# EAGLE design PicoElf2 (EAGLE 4.11)
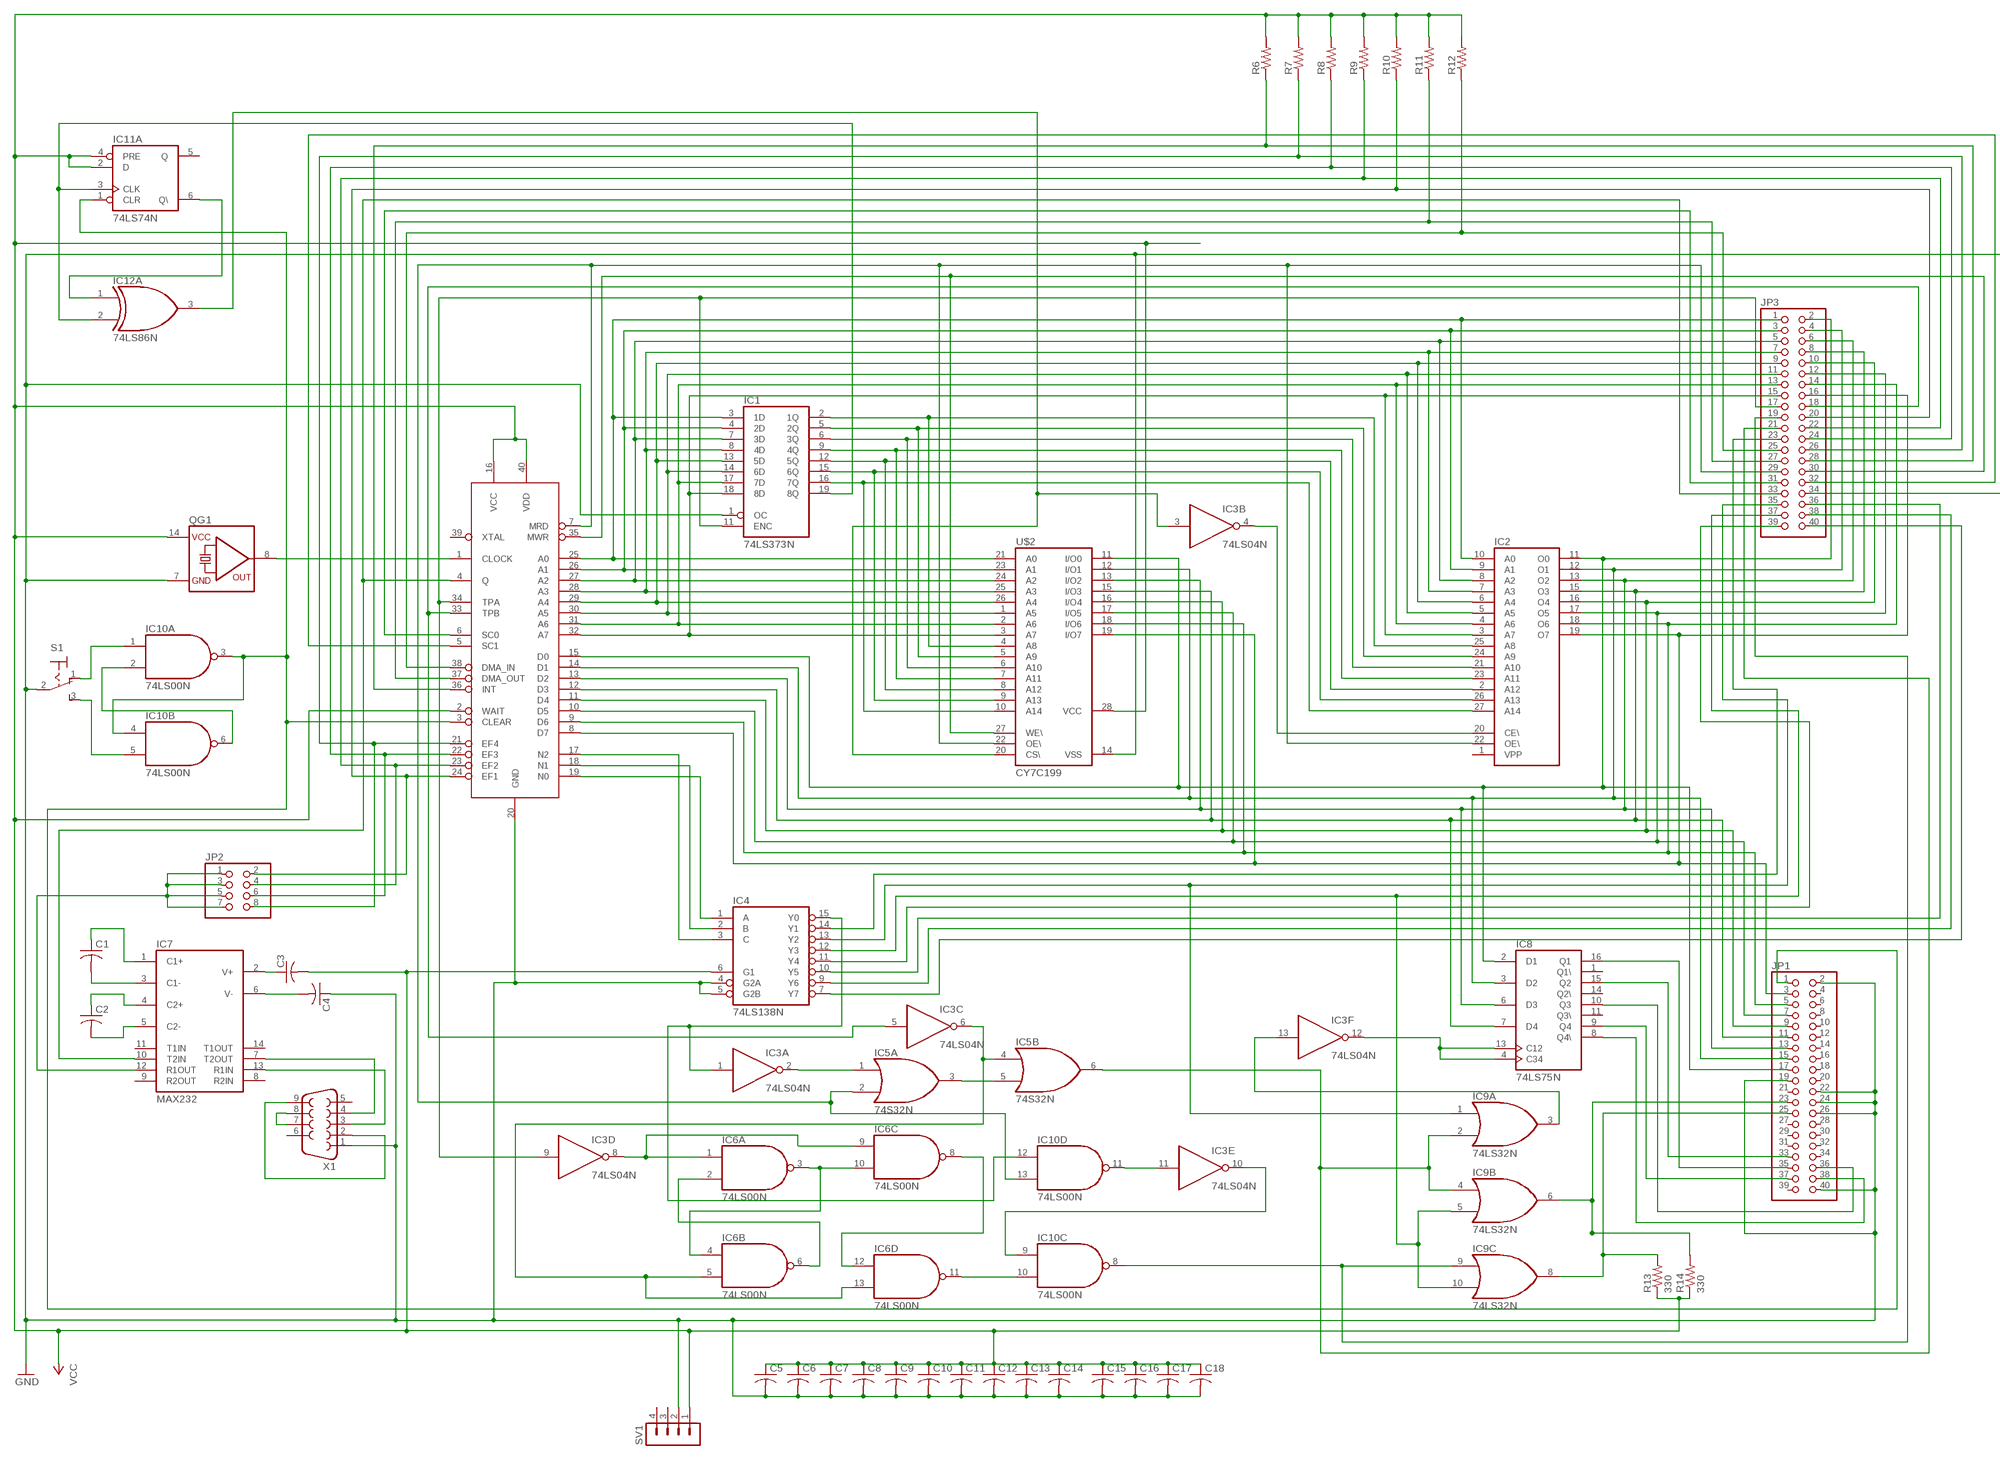
[diagram p0: schematic, sheet 1]

## Parts
C1  C-US025-025X050  [C025-025X050]
C2  C-US025-025X050  [C025-025X050]
C3  C-US025-025X050  [C025-025X050]
C4  C-US025-025X050  [C025-025X050]
C5  C-US025-025X050  [C025-025X050]
C6  C-US025-025X050  [C025-025X050]
C7  C-US025-025X050  [C025-025X050]
C8  C-US025-025X050  [C025-025X050]
C9  C-US025-025X050  [C025-025X050]
C10  C-US025-025X050  [C025-025X050]
C11  C-US025-025X050  [C025-025X050]
C12  C-US025-025X050  [C025-025X050]
C13  C-US025-025X050  [C025-025X050]
C14  C-US025-025X050  [C025-025X050]
C15  C-US025-025X050  [C025-025X050]
C16  C-US025-025X050  [C025-025X050]
C17  C-US025-025X050  [C025-025X050]
C18  C-US025-025X050  [C025-025X050]
IC1  74LS373N  [DIL20]
IC2  27256  [DIL28]
IC3  74LS04N  [DIL14]
IC4  74LS138N  [DIL16]
IC5  74S32N  [DIL14]
IC6  74LS00N  [DIL14]
IC7  MAX232  [DIL16]
IC8  74LS75N  [DIL16]
IC9  74LS32N  [DIL14]
IC10  74LS00N  [DIL14]
IC11  74LS74N  [DIL14]
IC12  74LS86N  [DIL14]
JP1  PINHD-2X20  [2X20]
JP2  PINHD-2X4  [2X04]
JP3  PINHD-2X20  [2X20]
QG1  QG5860  [DIL14S]
R6  R-US_0207/2V  [0207/2V]
R7  R-US_0207/2V  [0207/2V]
R8  R-US_0207/2V  [0207/2V]
R9  R-US_0207/2V  [0207/2V]
R10  R-US_0207/2V  [0207/2V]
R11  R-US_0207/2V  [0207/2V]
R12  R-US_0207/2V  [0207/2V]
R13  330  R-US_0207/2V  [0207/2V]
R14  330  R-US_0207/2V  [0207/2V]
S1  320-916  [320-916]
SV1  MA04-1  [MA04-1]
U$1  CDP1802BCECDP1802BCE  [DIL40]
U$2  CY7C199  [DIL28-3]
X1  F09H  [F09H]

## Nets
A0: IC1.3(1D) IC2.10(A0) JP3.1 U$1.25(A0) U$2.21(A0)
A1: IC1.4(2D) IC2.9(A1) JP3.3 U$1.26(A1) U$2.23(A1)
A2: IC1.7(3D) IC2.8(A2) JP3.5 U$1.27(A2) U$2.24(A2)
A3: IC1.8(4D) IC2.7(A3) JP3.7 U$1.28(A3) U$2.25(A3)
A4: IC1.13(5D) IC2.6(A4) JP3.9 U$1.29(A4) U$2.26(A4)
A5: IC1.14(6D) IC2.5(A5) JP3.11 U$1.30(A5) U$2.1(A5)
A6: IC1.17(7D) IC2.4(A6) JP3.13 U$1.31(A6) U$2.2(A6)
A7: IC1.18(8D) IC2.3(A7) JP3.15 U$1.32(A7) U$2.3(A7)
A8: IC1.2(1Q) IC2.25(A8) U$2.4(A8)
A9: IC1.5(2Q) IC2.24(A9) U$2.5(A9)
A10: IC1.6(3Q) IC2.21(A10) U$2.6(A10)
A11: IC1.9(4Q) IC2.23(A11) U$2.7(A11)
A12: IC1.12(5Q) IC2.2(A12) U$2.8(A12)
A13: IC1.15(6Q) IC2.26(A13) U$2.9(A13)
A14: IC1.16(7Q) IC2.27(A14) U$2.10(A14)
A15: IC1.19(8Q) IC11.3(A:CLK) IC12.2(A:I1)
CLOCK: QG1.8(OUT) U$1.1(CLOCK)
D0: IC2.11(O0) IC8.2(D1) JP1.17 JP3.2 U$1.15(D0) U$2.11(I/O0)
D1: IC2.12(O1) IC8.3(D2) JP1.15 JP3.4 U$1.14(D1) U$2.12(I/O1)
D2: IC2.13(O2) IC8.6(D3) JP1.13 JP3.6 U$1.13(D2) U$2.13(I/O2)
D3: IC2.15(O3) IC8.7(D4) JP1.11 JP3.8 U$1.12(D3) U$2.15(I/O3)
D4: IC2.16(O4) JP1.9 JP3.10 U$1.11(D4) U$2.16(I/O4)
D5: IC2.17(O5) JP1.7 JP3.12 U$1.10(D5) U$2.17(I/O5)
D6: IC2.18(O6) JP1.5 JP3.14 U$1.9(D6) U$2.18(I/O6)
D7: IC2.19(O7) JP1.3 JP3.16 U$1.8(D7) U$2.19(I/O7)
DMA_IN: JP3.25 R12.1 U$1.38(DMA_IN)
DMA_OUT: JP3.27 R11.1 U$1.37(DMA_OUT)
EF1: JP2.2 JP3.20 R10.1 U$1.24(EF1)
EF2: JP2.4 JP3.22 R9.1 U$1.23(EF2)
EF3: JP2.6 JP3.24 R8.1 U$1.22(EF3)
EF4: JP2.8 JP3.26 R7.1 U$1.21(EF4)
GND: C4.1 C5.2 C6.2 C7.2 C8.2 C9.2 C10.2 C11.2 C12.2 C13.2 C14.2 C15.2 C16.2 C17.2 C18.2 IC1.1(OC) IC4.4(G2A) IC4.5(G2B) JP1.2 JP1.19 JP1.22 JP1.24 JP1.26 JP1.40 JP3.34 QG1.7(GND) S1.2(P) SV1.2 U$1.20(GND) U$2.14(VSS) X1.1
INP: IC9.9(C:I0) IC10.8(C:O) JP3.19
INT: JP3.28 R6.1 U$1.36(INT)
MRD: IC2.22(OE\) IC5.2(A:I1) IC10.13(D:I1) JP3.29 U$1.7(MRD) U$2.22(OE\)
MWR: JP3.30 U$1.35(MWR) U$2.27(WE\)
N$1: IC2.20(CE\) IC3.4(B:O)
N$2: IC11.6(A:Q\) IC12.1(A:I0)
N$3: IC4.1(A) U$1.19(N0)
N$4: IC4.2(B) U$1.18(N1)
N$5: IC4.3(C) U$1.17(N2)
N$6: IC3.1(A:I) IC4.15(Y0) IC10.12(D:I0)
N$7: IC3.2(A:O) IC5.1(A:I0)
N$8: IC6.3(A:O) IC6.4(B:I0) IC6.10(C:I1)
N$9: IC5.3(A:O) IC5.5(B:I1)
N$10: IC3.6(C:O) IC5.4(B:I0) IC6.5(B:I1) IC6.13(D:I1)
N$11: IC6.2(A:I1) IC6.6(B:O)
N$12: IC3.8(D:O) IC6.1(A:I0) IC6.9(C:I0)
N$13: IC3.10(E:O) IC10.9(C:I0)
N$14: IC6.8(C:O) IC6.12(D:I0)
N$15: IC3.13(F:I) IC9.3(A:O)
N$16: IC6.11(D:O) IC10.10(C:I1)
N$17: IC3.11(E:I) IC10.11(D:O)
N$19: JP3.32 U$1.5(SC1)
N$20: IC3.3(B:I) IC12.3(A:O) U$2.20(CS\)
N$21: C2.1 IC7.4(C2+)
N$22: C2.2 IC7.5(C2-)
N$23: IC3.12(F:O) IC8.4(C34) IC8.13(C12)
N$24: IC8.16(Q1) JP1.35
N$25: IC8.15(Q2) JP1.33
N$26: IC8.10(Q3) JP1.36
N$27: IC8.9(Q4) JP1.37
N$28: IC8.8(Q4\) JP1.38
N$29: IC9.6(B:O) JP1.23 R14.2
N$30: IC9.8(C:O) JP1.25 R13.2
N$31: C1.2 IC7.3(C1-)
N$32: IC7.13(R1IN) X1.3
N$33: IC10.1(A:I0) S1.1(O)
N$34: C1.1 IC7.1(C1+)
N$35: X1.7 X1.8
N$36: X1.2 X1.9
N$37: IC7.12(R1OUT) JP2.1 JP2.3 JP2.5 JP2.7
N$38: C3.1 IC7.2(V+)
N$39: C4.2 IC7.6(V-)
N$40: IC7.7(T2OUT) X1.4
N$43: IC10.5(B:I1) S1.3(S)
N$46: IC10.2(A:I1) IC10.6(B:O)
OUT: IC5.6(B:O) IC9.2(A:I1) IC9.4(B:I0) JP3.21
PORT1: IC4.14(Y1) JP3.23
PORT2: IC4.13(Y2) IC9.1(A:I0) JP3.35
PORT3: IC4.12(Y3) IC9.5(B:I1) IC9.10(C:I1) JP3.37
PORT4: IC4.11(Y4) JP3.39
PORT5: IC4.10(Y5) JP3.36
PORT6: IC4.9(Y6) JP3.38
PORT7: IC4.7(Y7) JP3.40
Q: IC7.10(T2IN) JP3.33 U$1.4(Q)
RESET: IC10.3(A:O) IC10.4(B:I0) IC11.1(A:CLR) JP1.1 U$1.3(CLEAR)
SC0: JP3.31 U$1.6(SC0)
TPA: IC1.11(ENC) IC3.9(D:I) JP3.17 U$1.34(TPA)
TPB: IC3.5(C:I) JP3.18 U$1.33(TPB)
VCC: C3.2 C5.1 C6.1 C7.1 C8.1 C9.1 C10.1 C11.1 C12.1 C13.1 C14.1 C15.1 C16.1 C17.1 C18.1 IC4.6(G1) IC11.2(A:D) IC11.4(A:PRE) QG1.14(VCC) R6.2 R7.2 R8.2 R9.2 R10.2 R11.2 R12.2 R13.1 R14.1 SV1.1 U$1.2(WAIT) U$1.16(VCC) U$1.40(VDD) U$2.28(VCC)
Unconnected: IC2.1(VPP) IC5.8(C:O) IC5.9(C:I0) IC5.10(C:I1) IC5.11(D:O) IC5.12(D:I0) IC5.13(D:I1) IC7.8(R2IN) IC7.9(R2OUT) IC7.11(T1IN) IC7.14(T1OUT) IC8.1(Q1\) IC8.11(Q3\) IC8.14(Q2\) IC9.11(D:O) IC9.12(D:I0) IC9.13(D:I1) IC11.5(A:Q) IC11.8(B:Q\) IC11.9(B:Q) IC11.10(B:PRE) IC11.11(B:CLK) IC11.12(B:D) IC11.13(B:CLR) IC12.4(B:I0) IC12.5(B:I1) IC12.6(B:O) IC12.8(C:O) IC12.9(C:I0) IC12.10(C:I1) IC12.11(D:O) IC12.12(D:I0) IC12.13(D:I1) JP1.4 JP1.6 JP1.8 JP1.10 JP1.12 JP1.14 JP1.16 JP1.18 JP1.20 JP1.21 JP1.27 JP1.28 JP1.29 JP1.30 JP1.31 JP1.32 JP1.34 JP1.39 SV1.3 SV1.4 U$1.39(XTAL) X1.5 X1.6

## Power pins joined to a net without a drawn wire
GND: IC1.10(GND) IC2.14(GND) IC3.7(P:GND) IC4.8(GND) IC5.7(P:GND) IC6.7(P:GND) IC7.15(GND) IC8.12(GND) IC9.7(P:GND) IC10.7(P:GND) IC11.7(P:GND) IC12.7(P:GND)
VCC: IC1.20(VCC) IC2.28(VCC) IC3.14(P:VCC) IC4.16(VCC) IC5.14(P:VCC) IC6.14(P:VCC) IC7.16(VCC) IC8.5(VCC) IC9.14(P:VCC) IC10.14(P:VCC) IC11.14(P:VCC) IC12.14(P:VCC)

## Library data of the parts
C1-C18 = rcl:C-US: CAPACITOR, American symbol
IC1 = 74xx-us:74*373: Octal D type transparent LATCH, edge triggered
IC2 = memory:27256: MEMORY
IC3 = 74xx-us:74*04: Hex INVERTER
IC4 = 74xx-us:74*138: 3-line to 8-line DECODER/DEMULTIPLEXER
IC5 IC9 = 74xx-us:74*32: Quad 2-input OR gate
IC6 IC10 = 74xx-us:74*00: Quad 2-input NAND gate
IC7 = maxim:MAX232: RS232 TRANSEIVER
IC8 = 74xx-us:74*75: 4-bit bistable LATCH
IC11 = 74xx-us:74*74: Dual D type positive edge triggered FLIP FLOP, preset and clear
IC12 = 74xx-us:74*86: Quad 2-input EXCLUSIV-OR (XOR) gate
JP1 JP3 = pinhead:PINHD-2X20: PIN HEADER
JP2 = pinhead:PINHD-2X4: PIN HEADER
QG1 = crystal:QG5860: CRYSTAL RESONATOR
R6-R14 = rcl:R-US_: RESISTOR, American symbol
S1 = switch:320-916: TOGGLE SWITCH distributor RS Components
SV1 = con-lstb:MA04-1: PIN HEADER
U$1 = cdp:CDP1802BCE
U$2 = cdp:CY7C199
X1 = con-subd:F09: SUB-D

## Board
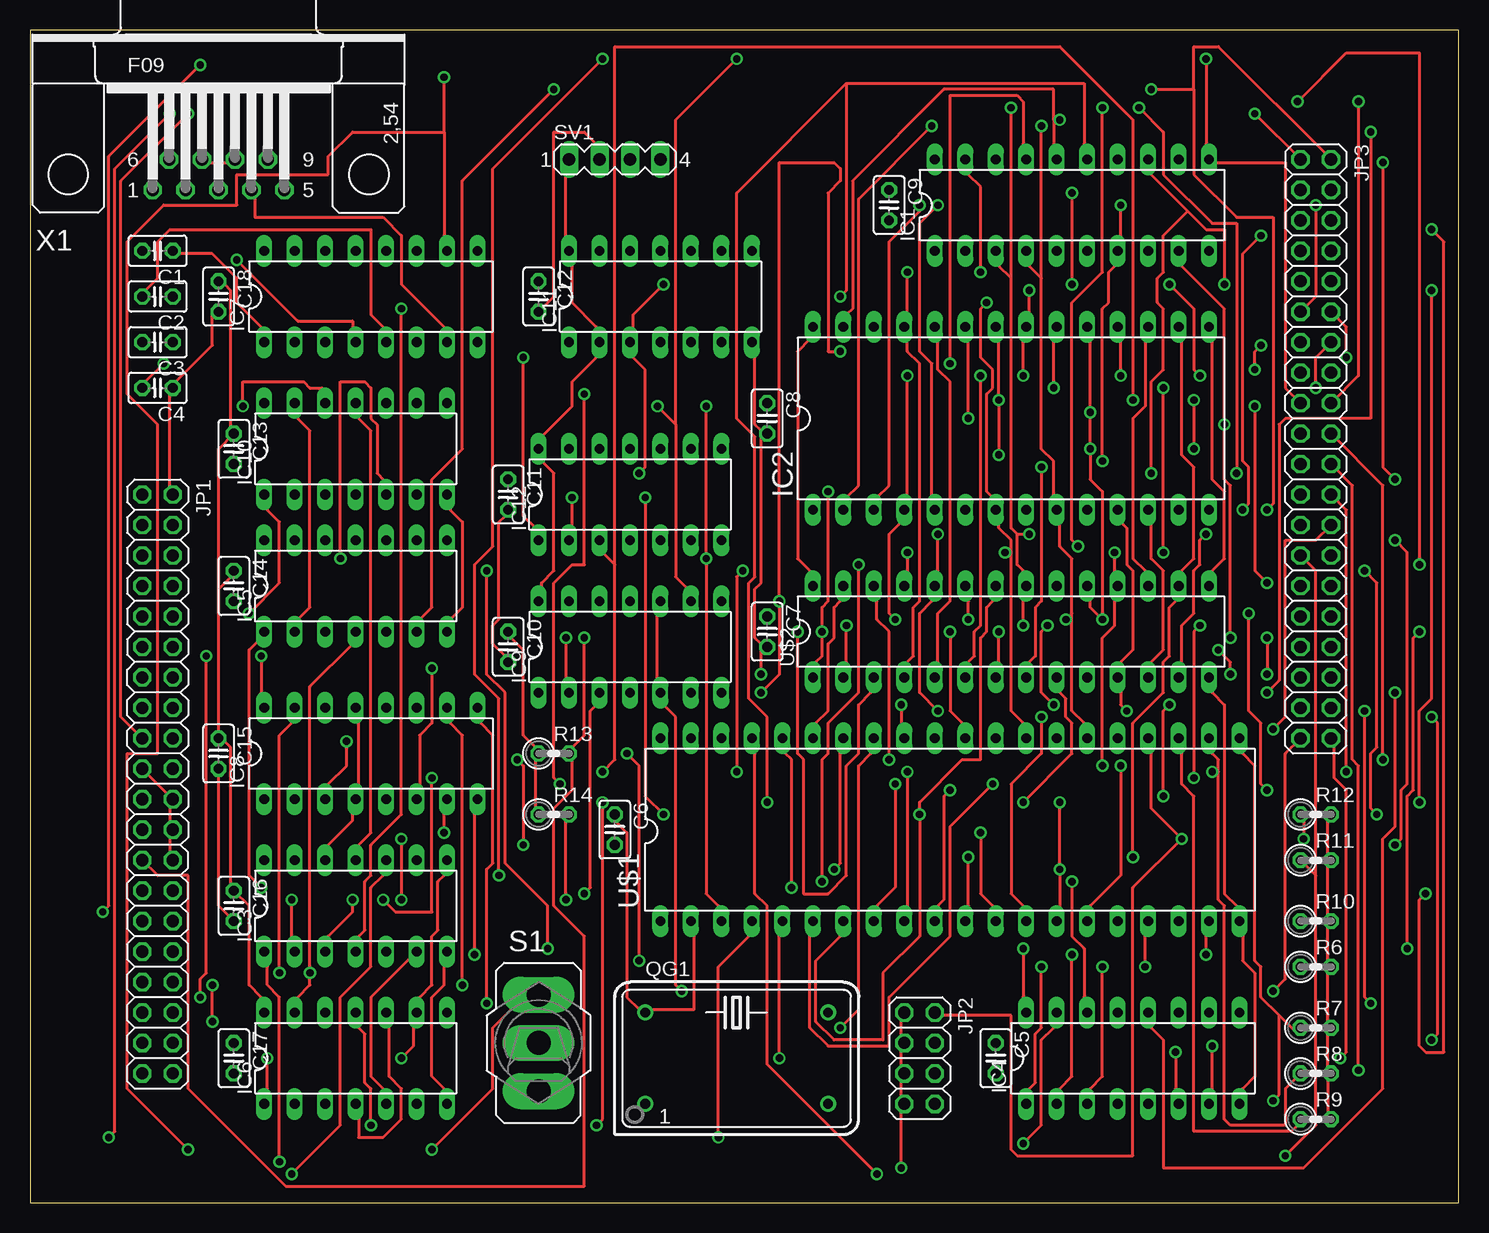
[diagram p1: board, top side]
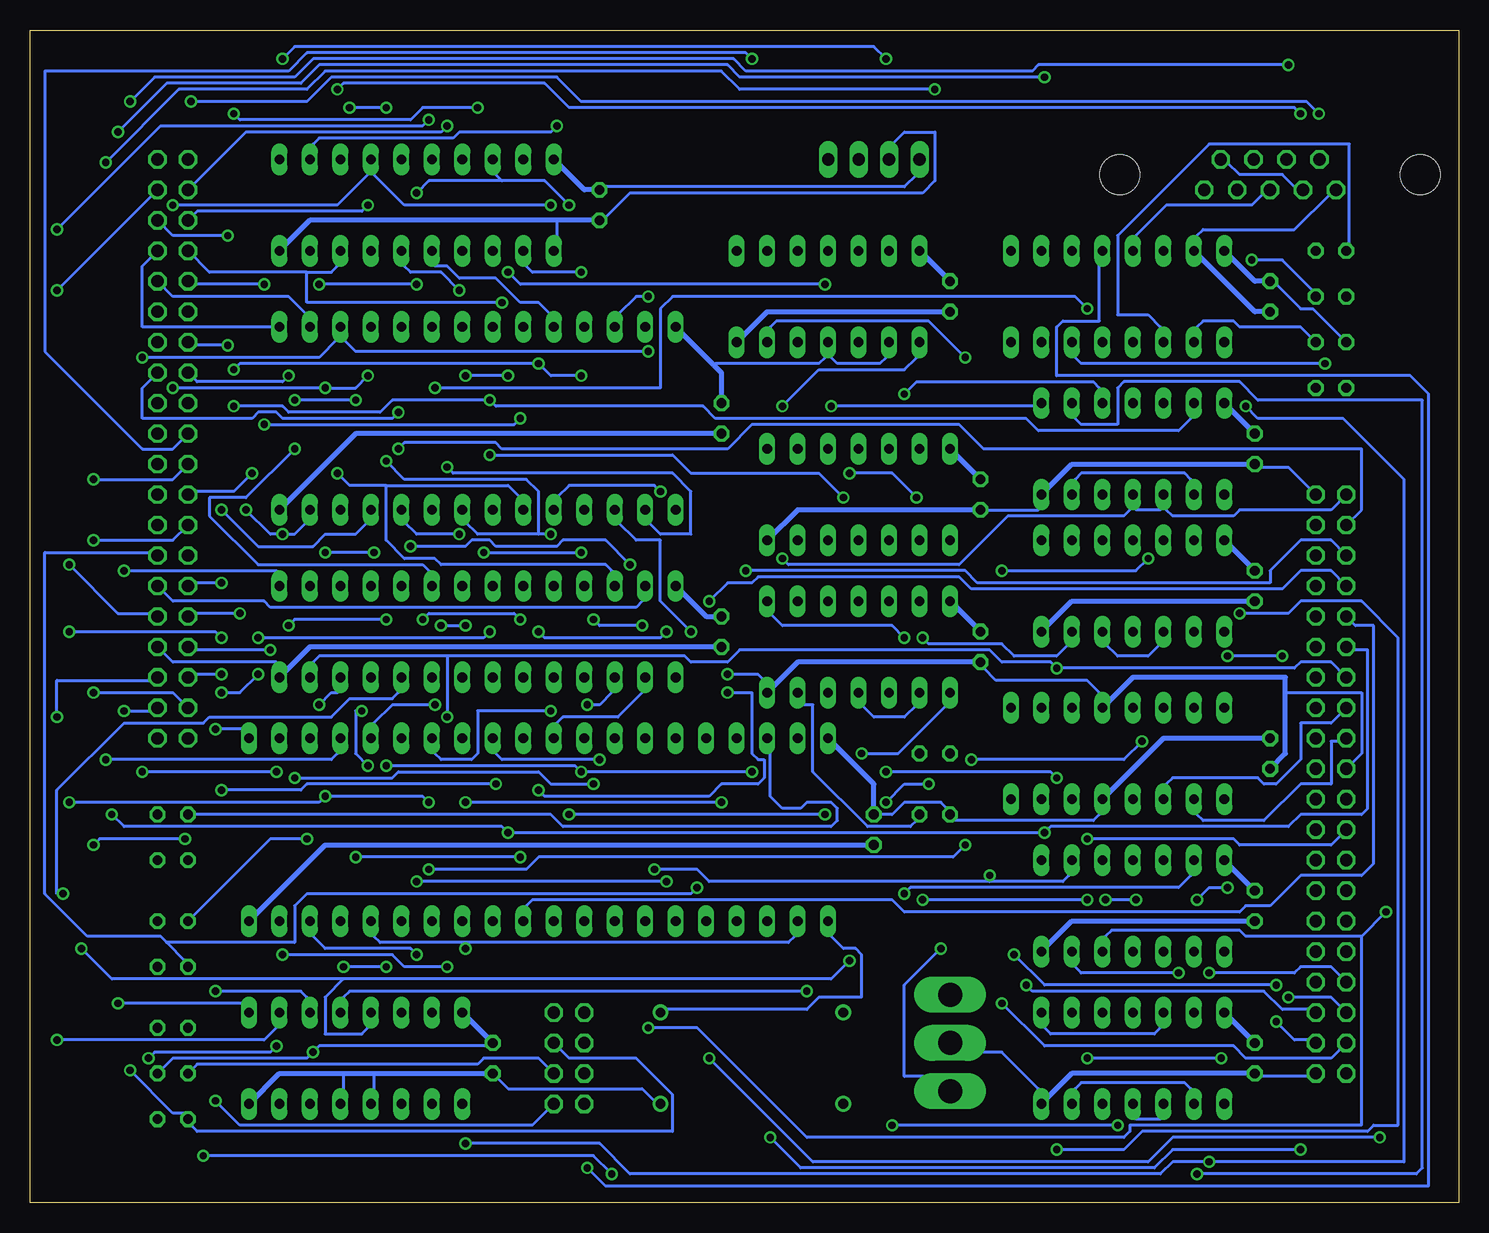
[diagram p2: board, bottom side, seen from below]

Size 119.05 x 97.78 mm. Coordinates in mm from the lower left corner, seen from the top.
Outline: 0,0 119.05,0 119.05,97.78 0,97.78 0,0
Copper layers (1*16): Top 0.035mm / dielectric 1.5mm / Bottom 0.035mm
Design rules "default": minimum track width 10mil, minimum drill 24mil, track to track 8mil, track to pad 8mil, pad to pad 8mil, via to via 8mil, smd to smd 8mil, copper to edge 40mil, drill to drill 8mil, minimum pad ring 10mil, minimum via ring 8mil, stop-mask expansion 4mil, vias tented up to drill 0mil, thermal gap 10mil

### Footprints (pad centres in the part's own frame; a part is rotated, then mirrored left to right if it is on the bottom)
C025-025X050 = drill 0.813 octagon: 1 -1.27,0; 2 1.27,0
DIL20 = drill 0.813 long: 1 -11.43,-3.81; 2 -8.89,-3.81; 3 -6.35,-3.81; 4 -3.81,-3.81; 5 -1.27,-3.81; 6 1.27,-3.81; 7 3.81,-3.81; 8 6.35,-3.81; 9 8.89,-3.81; 10 11.43,-3.81; 11 11.43,3.81; 12 8.89,3.81; 13 6.35,3.81; 14 3.81,3.81; 15 1.27,3.81; 16 -1.27,3.81; 17 -3.81,3.81; 18 -6.35,3.81; 19 -8.89,3.81; 20 -11.43,3.81
DIL28 = drill 0.813 long: 1 -16.51,-7.62; 2 -13.97,-7.62; 3 -11.43,-7.62; 4 -8.89,-7.62; 5 -6.35,-7.62; 6 -3.81,-7.62; 7 -1.27,-7.62; 8 1.27,-7.62; 9 3.81,-7.62; 10 6.35,-7.62; 11 8.89,-7.62; 12 11.43,-7.62; 13 13.97,-7.62; 14 16.51,-7.62; 15 16.51,7.62; 16 13.97,7.62; 17 11.43,7.62; 18 8.89,7.62; 19 6.35,7.62; 20 3.81,7.62; 21 1.27,7.62; 22 -1.27,7.62; 23 -3.81,7.62; 24 -6.35,7.62; 25 -8.89,7.62; 26 -11.43,7.62; 27 -13.97,7.62; 28 -16.51,7.62
DIL14 = drill 0.813 long: 1 -7.62,-3.81; 2 -5.08,-3.81; 3 -2.54,-3.81; 4 0,-3.81; 5 2.54,-3.81; 6 5.08,-3.81; 7 7.62,-3.81; 8 7.62,3.81; 9 5.08,3.81; 10 2.54,3.81; 11 0,3.81; 12 -2.54,3.81; 13 -5.08,3.81; 14 -7.62,3.81
DIL16 = drill 0.813 long: 1 -8.89,-3.81; 2 -6.35,-3.81; 3 -3.81,-3.81; 4 -1.27,-3.81; 5 1.27,-3.81; 6 3.81,-3.81; 7 6.35,-3.81; 8 8.89,-3.81; 9 8.89,3.81; 10 6.35,3.81; 11 3.81,3.81; 12 1.27,3.81; 13 -1.27,3.81; 14 -3.81,3.81; 15 -6.35,3.81; 16 -8.89,3.81
2X20 = drill 1.016 octagon: 1 -24.13,-1.27; 2 -24.13,1.27; 3 -21.59,-1.27; 4 -21.59,1.27; 5 -19.05,-1.27; 6 -19.05,1.27; 7 -16.51,-1.27; 8 -16.51,1.27; 9 -13.97,-1.27; 10 -13.97,1.27; 11 -11.43,-1.27; 12 -11.43,1.27; 13 -8.89,-1.27; 14 -8.89,1.27; 15 -6.35,-1.27; 16 -6.35,1.27; 17 -3.81,-1.27; 18 -3.81,1.27; 19 -1.27,-1.27; 20 -1.27,1.27; 21 1.27,-1.27; 22 1.27,1.27; 23 3.81,-1.27; 24 3.81,1.27; 25 6.35,-1.27; 26 6.35,1.27; 27 8.89,-1.27; 28 8.89,1.27; 29 11.43,-1.27; 30 11.43,1.27; 31 13.97,-1.27; 32 13.97,1.27; 33 16.51,-1.27; 34 16.51,1.27; 35 19.05,-1.27; 36 19.05,1.27; 37 21.59,-1.27; 38 21.59,1.27; 39 24.13,-1.27; 40 24.13,1.27
2X04 = drill 1.016 octagon: 1 -3.81,-1.27; 2 -3.81,1.27; 3 -1.27,-1.27; 4 -1.27,1.27; 5 1.27,-1.27; 6 1.27,1.27; 7 3.81,-1.27; 8 3.81,1.27
DIL14S = drill 0.813 round: 1 -7.62,-3.81; 7 7.62,-3.81; 8 7.62,3.81; 14 -7.62,3.81
0207/2V = drill 0.813 octagon: 1 -1.27,0; 2 1.27,0
320-916 = drill 2.007 long: 1 0,4.013; 2 0,0; 3 0,-4.013
MA04-1 = drill 1.016 long: 1 -3.81,0; 2 -1.27,0; 3 1.27,0; 4 3.81,0
DIL40 = drill 0.813 long: 1 -24.13,-7.62; 2 -21.59,-7.62; 3 -19.05,-7.62; 4 -16.51,-7.62; 5 -13.97,-7.62; 6 -11.43,-7.62; 7 -8.89,-7.62; 8 -6.35,-7.62; 9 -3.81,-7.62; 10 -1.27,-7.62; 11 1.27,-7.62; 12 3.81,-7.62; 13 6.35,-7.62; 14 8.89,-7.62; 15 11.43,-7.62; 16 13.97,-7.62; 17 16.51,-7.62; 18 19.05,-7.62; 19 21.59,-7.62; 20 24.13,-7.62; 21 24.13,7.62; 22 21.59,7.62; 23 19.05,7.62; 24 16.51,7.62; 25 13.97,7.62; 26 11.43,7.62; 27 8.89,7.62; 28 6.35,7.62; 29 3.81,7.62; 30 1.27,7.62; 31 -1.27,7.62; 32 -3.81,7.62; 33 -6.35,7.62; 34 -8.89,7.62; 35 -11.43,7.62; 36 -13.97,7.62; 37 -16.51,7.62; 38 -19.05,7.62; 39 -21.59,7.62; 40 -24.13,7.62
DIL28-3 = drill 0.813 long: 1 -16.51,-3.81; 2 -13.97,-3.81; 3 -11.43,-3.81; 4 -8.89,-3.81; 5 -6.35,-3.81; 6 -3.81,-3.81; 7 -1.27,-3.81; 8 1.27,-3.81; 9 3.81,-3.81; 10 6.35,-3.81; 11 8.89,-3.81; 12 11.43,-3.81; 13 13.97,-3.81; 14 16.51,-3.81; 15 16.51,3.81; 16 13.97,3.81; 17 11.43,3.81; 18 8.89,3.81; 19 6.35,3.81; 20 3.81,3.81; 21 1.27,3.81; 22 -1.27,3.81; 23 -3.81,3.81; 24 -6.35,3.81; 25 -8.89,3.81; 26 -11.43,3.81; 27 -13.97,3.81; 28 -16.51,3.81
F09H = drill 1.016 octagon: 1 -5.486,-1.27; 2 -2.743,-1.27; 3 0,-1.27; 4 2.743,-1.27; 5 5.486,-1.27; 6 -4.115,1.27; 7 -1.372,1.27; 8 1.372,1.27; 9 4.115,1.27 | hole 3.302: -12.522,0; 12.522,0

### Placement (x,y rotation side)
C1  10.63,79.37 180 top
C2  10.63,75.56 180 top
C3  10.63,71.75 180 top
C4  10.63,67.94 180 top
C5  80.48,12.06 270 top
C6  48.73,31.11 270 top
C7  61.43,47.62 270 top
C8  61.43,65.4 270 top
C9  71.59,83.18 270 top
C10  39.84,46.35 270 top
C11  39.84,59.05 270 top
C12  42.38,75.56 270 top
C13  16.98,62.86 270 top
C14  16.98,51.43 270 top
C15  15.71,37.46 270 top
C16  16.98,24.76 270 top
C17  16.98,12.06 270 top
C18  15.71,75.56 270 top
IC1  86.83,83.18 0 top
IC2  81.75,65.4 0 top
IC3  27.14,24.76 0 top
IC4  91.91,12.06 0 top
IC5  27.14,51.43 0 top
IC6  27.14,12.06 0 top
IC7  28.41,75.56 0 top
IC8  28.41,37.46 0 top
IC9  50,46.35 0 top
IC10  27.14,62.86 0 top
IC11  52.54,75.56 0 top
IC12  50,59.05 0 top
JP1  10.63,34.92 270 top
JP2  74.13,12.06 270 top
JP3  107.15,62.86 270 top
QG1  58.89,12.06 0 top
R6  107.15,19.68 0 top
R7  107.15,14.6 0 top
R8  107.15,10.79 0 top
R9  107.15,6.98 0 top
R10  107.15,23.49 0 top
R11  107.15,28.57 0 top
R12  107.15,32.38 0 top
R13  43.65,37.46 0 top
R14  43.65,32.38 0 top
S1  42.38,13.33 0 top
SV1  48.73,86.99 0 top
U$1  76.67,31.11 0 top
U$2  81.75,47.62 0 top
X1  15.71,85.72 0 top

### Tracks (layer width: path | path; a pad name or v marks a point on that pad's centre or on a via)
A0  (via drill 0.61)
  Top 0.254: 82.26,55.75 82.26,53.21 82.77,52.7 U$2.21 82.77,50.16 v82.77,48.13 | 82.26,55.75 81.75,56.26 81.75,77.08 | 81.75,77.08 80.73,78.1 IC1.3 | v85.31,41.52 84.29,42.54 84.29,47.62 v84.8,48.13 | 82.26,55.75 v83.27,55.75 | 81.75,77.08 v81.75,91.31 | v102.07,90.8 JP3.1
  Bottom 0.254: v85.31,41.52 88.86,41.52 90.39,40 U$1.25 | v84.8,48.13 v82.77,48.13 | v83.27,55.75 86.83,55.75 87.85,56.76 IC2.10 | v102.07,90.8 101.56,90.29 87.34,90.29 86.32,91.31 v81.75,91.31
A1  (via drill 0.61)
  Top 0.254: v78.19,48.64 78.19,50.16 U$2.23 | 86.83,49.14 v86.32,48.64 | 86.83,49.14 86.83,53.72 85.81,54.73 85.81,56.76 IC2.9 85.31,58.8 85.31,61.84 84.29,62.86 84.29,77.08 | 86.83,49.14 86.83,41.02 87.85,40 U$1.26 | 84.29,77.08 83.27,78.1 IC1.4 | 84.29,77.08 v84.29,89.78
  Bottom 0.254: v78.19,48.64 78.7,49.14 85.81,49.14 v86.32,48.64 | v84.29,89.78 84.8,89.28 101.05,89.28 JP3.3
A2  (via drill 0.61)
  Top 0.254: v90.89,83.18 90.89,80.64 IC1.7 90.39,78.1 89.88,77.59 89.88,75.05 89.37,74.54 v89.37,61.84 | v75.65,41.02 74.13,42.54 74.13,49.14 75.15,50.16 U$2.24 75.65,52.7 v75.65,55.75
  Bottom 0.254: v90.89,83.18 91.4,82.67 105.12,82.67 JP3.5 | v75.65,41.02 81.75,41.02 81.75,37.46 82.26,36.95 84.8,36.95 85.31,37.46 U$1.27 | v75.65,55.75 76.67,55.75 | 76.67,55.75 81.75,55.75 82.77,56.76 IC2.8 | v89.37,61.84 87.85,60.32 77.69,60.32 76.67,59.3 76.67,55.75
A3  (via drill 0.61)
  Top 0.254: 81.75,54.22 81.75,55.24 80.73,56.26 80.73,56.76 IC2.7 80.23,58.8 79.72,59.3 79.72,67.43 80.23,67.94 80.23,69.46 79.21,70.48 79.21,74.54 v79.72,75.05 | 81.75,54.22 81.75,41.02 82.77,40 U$1.28 | v73.11,54.22 73.11,52.7 U$2.25 | 81.75,54.22 v81.24,54.22
  Bottom 0.254: 95.97,77.59 104.1,77.59 JP3.7 | 95.97,77.59 93.94,77.59 93.43,78.1 IC1.8 | v81.24,54.22 v73.11,54.22 | 95.97,77.59 95.97,75.05 v79.72,75.05
A4  (via drill 0.61)
  Top 0.254: 96.48,82.67 98.01,81.15 99.53,81.15 v99.53,76.58 | 96.48,82.67 93.43,85.72 IC1.13 | v71.59,36.95 71.59,47.62 70.57,48.64 70.57,50.16 U$2.26 | 96.48,82.67 94.45,80.64 94.45,77.59 93.94,77.08 93.94,75.05 94.45,74.54 94.45,69.46 93.43,68.45 v93.43,60.83
  Bottom 0.254: v99.53,76.58 105.63,76.58 JP3.9 | 89.37,59.81 89.37,55.24 87.85,53.72 85.31,53.72 84.8,53.21 71.08,53.21 70.57,52.7 U$2.26 | 89.37,59.81 79.21,59.81 78.19,58.8 IC2.6 | v71.59,36.95 79.72,36.95 80.23,37.46 U$1.29 | v93.43,60.83 92.42,59.81 89.37,59.81
A5  (via drill 0.61)
  Top 0.254: v107.15,83.18 107.15,75.56 JP3.11 | v66.51,59.3 66.51,50.16 66,49.65 v66,47.62 66,45.59 65.49,45.08 U$2.1 | v76.67,47.62 76.67,41.02 77.69,40 U$1.30 | v75.65,83.18 74.13,81.66 74.13,70.99 75.15,69.97 75.15,58.8 IC2.5
  Bottom 0.254: v107.15,83.18 93.43,83.18 90.89,85.72 IC1.14 90.39,85.72 87.85,83.18 v75.65,83.18 | v66.51,59.3 67.02,59.81 74.13,59.81 75.15,58.8 IC2.5 | v76.67,47.62 76.16,47.11 66.51,47.11 v66,47.62
A6  (via drill 0.61)
  Top 0.254: v72.1,48.64 71.59,49.14 71.59,55.75 72.61,56.76 IC2.4 73.11,58.8 v73.11,68.96 | v68.03,48.13 68.03,45.08 U$2.2 | v76.67,69.97 76.67,92.32 82.26,92.32 82.77,91.82 82.77,88.26 IC1.17 | v102.58,71.5 102.07,70.99 v102.07,69.46
  Bottom 0.254: U$2.2 68.03,42.54 70.07,40.51 74.64,40.51 75.15,40 U$1.31 | v72.1,48.64 71.59,48.13 v68.03,48.13 | v73.11,68.96 75.65,68.96 v76.67,69.97 101.56,69.97 v102.07,69.46 | v102.58,71.5 105.63,71.5 JP3.13
A7  (via drill 0.61)
  Top 0.254: v72.61,41.52 72.61,40 U$1.32 | v74.13,83.18 74.13,82.67 71.59,80.13 71.59,59.81 70.57,58.8 IC2.3 | v97.5,68.96 96.99,69.46 96.99,74.54 v94.96,76.58 | v86.83,84.2 v86.83,76.58 | v63.97,47.62 63.97,37.46 64.48,36.95 64.48,25.78 66.51,25.78 68.03,27.3 68.03,36.44 69.05,37.46 69.05,41.52 70.07,42.54 U$2.3
  Bottom 0.254: v72.61,41.52 71.59,41.52 70.57,42.54 U$2.3 | v74.13,83.18 76.16,85.21 79.72,85.21 | 79.72,85.21 80.23,85.72 IC1.18 | v97.5,68.96 98.01,68.45 105.12,68.45 JP3.15 | v86.83,76.58 v94.96,76.58 | v86.83,84.2 85.81,85.21 79.72,85.21 | v63.97,47.62 66.51,50.16 66.51,55.24 68.54,55.24 70.07,56.76 IC2.3
A8  (via drill 0.61)
  Top 0.254: U$2.4 73.11,45.08 73.62,45.59 73.62,49.65 74.13,50.16 74.13,69.97 73.11,70.99 73.11,72 IC2.25 73.11,74.04 v73.11,77.59
  Bottom 0.254: v73.11,77.59 77.18,77.59 77.69,78.1 IC1.2
A9
  Top 0.254: U$2.5 75.65,45.08 75.65,49.14 76.67,50.16 76.67,68.45 75.65,69.46 75.65,72 IC2.24
  Bottom 0.254: IC1.5 85.31,78.1 84.29,78.1 83.27,77.08 80.23,77.08 78.19,75.05 76.67,75.05 75.65,74.04 IC2.24
A10  (via drill 0.61)
  Top 0.254: v79.21,68.96 79.21,48.13 78.7,47.62 78.7,45.59 78.19,45.08 U$2.6 | v82.77,68.96 82.77,72 IC2.21 83.27,74.04 v83.27,76.07
  Bottom 0.254: v79.21,68.96 v82.77,68.96 | v83.27,76.07 84.8,77.59 87.34,77.59 87.85,78.1 IC1.6
A11  (via drill 0.61)
  Top 0.254: v80.73,47.62 80.73,45.08 U$2.7 | v100.04,47.11 100.04,59.81 99.53,60.32 v99.53,64.89 99.53,74.54 95.97,78.1 IC1.9 | v78.19,65.4 78.19,72 IC2.23
  Bottom 0.254: v80.73,47.62 81.24,47.11 v100.04,47.11 | v78.19,65.4 78.7,64.89 v99.53,64.89
A12  (via drill 0.61)
  Top 0.254: v75.15,89.78 69.05,83.69 69.05,59.81 68.03,58.8 IC2.2 | v84.29,61.34 84.29,50.16 83.78,49.65 83.78,45.59 83.27,45.08 U$2.8
  Bottom 0.254: v75.15,89.78 75.65,89.28 83.27,89.28 83.78,88.77 94.96,88.77 95.47,88.26 IC1.12 | v84.29,61.34 83.78,60.83 65.49,60.83 63.97,59.3 63.97,55.75 66.51,55.75 67.53,56.76 IC2.2
A13  (via drill 0.61)
  Top 0.254: v82.77,33.4 86.83,37.46 86.83,40 86.32,40.51 86.32,42.03 85.81,42.54 U$2.9 | v61.43,33.4 61.43,40.51 59.91,42.03 59.91,51.68 60.41,52.19 60.41,63.88 58.89,65.4 58.89,84.2 68.03,93.34 | 68.03,93.34 87.85,93.34 87.85,88.26 IC1.15 | v67.53,75.56 68.03,76.07 68.03,93.34
  Bottom 0.254: v61.43,33.4 v82.77,33.4 | v67.53,75.56 68.54,75.56 70.07,74.04 IC2.26
A14  (via drill 0.61)
  Top 0.254: 85.31,90.29 85.31,88.26 IC1.16 | 85.31,90.29 85.31,92.83 76.16,92.83 68.54,85.21 68.54,74.54 68.03,74.04 IC2.27 | v116.29,25.78 115.79,25.27 115.79,13.08 116.29,12.57 117.82,12.57 117.82,80.13 v116.8,81.15 | v85.81,90.29 85.31,90.29
  Bottom 0.254: v116.29,25.78 116.8,25.78 116.8,34.41 111.21,40 104.61,40 104.1,40.51 93.94,40.51 92.42,42.03 88.86,42.03 88.35,42.54 U$2.10 | v116.8,81.15 108.17,89.78 86.32,89.78 v85.81,90.29
A15  (via drill 0.61)
  Top 0.254: v45.17,58.8 45.17,56.26 IC12.2 | v50.76,60.83 51.27,61.34 51.27,69.46 50.25,70.48 IC11.3 50.25,73.02 50.25,74.04 v52.79,76.58 | v79.21,77.59 79.21,84.7 78.19,85.72 IC1.19
  Bottom 0.254: v45.17,58.8 47.21,60.83 v50.76,60.83 | v79.21,77.59 78.19,76.58 v52.79,76.58
CLOCK
  Bottom 0.254: U$1.1 52.29,22.22 51.27,21.2 50.25,21.2 49.75,20.7 49.75,17.14 53.3,17.14 54.32,16.12 66,16.12 QG1.8
D0  (via drill 0.61)
  Top 0.254: v90.89,36.44 90.89,27.3 88.35,24.76 U$1.15 | v91.4,41.02 90.89,41.52 90.89,42.54 U$2.11 90.89,45.08 91.91,46.1 91.91,52.7 91.4,53.21 91.4,56.26 90.89,56.76 IC2.11 | 96.99,92.83 96.99,85.72 100.55,82.16 103.59,82.16 103.59,58.29 v103.09,57.78 | 96.99,92.83 96.99,96.39 99.02,96.39 JP3.2 | v13.17,90.8 7.58,85.21 7.58,40.51 JP1.17 | v93.43,92.83 96.99,92.83
  Bottom 0.254: IC8.2 21.81,32.38 21.3,31.87 16.22,31.87 13.17,34.92 10.63,34.92 10.63,38.48 9.61,38.48 JP1.17 | v90.89,36.44 91.91,37.46 91.91,41.02 v91.4,41.02 | v103.09,57.78 100.04,54.73 95.47,54.73 94.45,55.75 91.91,55.75 90.89,56.76 IC2.11 | v13.17,90.8 13.68,91.31 74.13,91.31 76.16,93.34 92.93,93.34 v93.43,92.83
D1  (via drill 0.61)
  Top 0.254: v85.81,33.4 v85.81,27.81 85.81,24.76 U$1.14 | v94.45,33.9 94.45,41.02 v94.96,41.52 | IC2.12 93.43,56.76 93.43,53.72 94.45,52.7 94.45,46.1 93.43,45.08 U$2.12 | v116.8,76.07 116.8,42.03 115.79,41.02 v115.79,33.4 | v26.38,38.48 26.38,36.44 24.85,34.92 IC8.3 | v40.6,36.95 41.11,36.44 v41.11,29.84
  Bottom 0.254: IC8.3 24.35,34.92 23.84,35.43 16.73,35.43 16.22,34.92 15.2,34.92 13.17,36.95 13.17,40 10.63,40 JP1.15 | v85.81,33.4 86.32,33.9 v94.45,33.9 94.96,33.4 v115.79,33.4 | v94.96,41.52 93.94,42.54 93.43,42.54 U$2.12 | v116.8,76.07 JP3.4 | v26.38,38.48 27.9,36.95 v40.6,36.95 | v41.11,29.84 42.13,28.82 76.67,28.82 77.69,27.81 v85.81,27.81
D2  (via drill 0.61)
  Top 0.254: v33.49,44.57 33.49,40 32.47,38.98 32.47,34.92 IC8.6 | v84.29,40.51 84.29,37.46 81.75,34.92 81.75,25.78 82.77,24.76 U$1.13 | v98.01,55.75 97.5,55.24 97.5,53.21 96.99,52.7 96.99,49.14 95.97,48.13 95.97,45.08 U$2.13 | v102.58,80.64 101.05,79.12 101.05,61.84 101.56,61.34 101.56,58.29 v101.05,57.78
  Bottom 0.254: JP1.13 10.63,45.08 13.17,45.08 13.68,44.57 v33.49,44.57 34,45.08 38.06,45.08 39.08,46.1 59.91,46.1 60.92,45.08 63.97,45.08 64.48,45.59 84.29,45.59 | 84.29,45.59 v84.29,40.51 | 84.29,45.59 94.96,45.59 95.47,45.08 U$2.13 | IC2.13 95.97,56.76 96.99,55.75 v98.01,55.75 99.02,55.75 v101.05,57.78 | v102.58,80.64 107.15,80.64 JP3.6
D3  (via drill 0.61)
  Top 0.254: U$2.15 98.51,52.7 99.53,53.72 99.53,59.3 98.51,60.32 98.51,72 IC2.15 | v34.51,30.86 34.51,32.38 IC8.7 | v79.21,30.86 79.21,25.78 80.23,24.76 U$1.12 | v111.21,52.7 112.23,51.68 112.23,37.97 111.72,37.46 111.72,32.89 v112.23,32.38
  Bottom 0.254: JP3.8 109.69,78.1 109.69,73.02 IC2.15 | JP1.11 9.11,46.1 7.58,46.1 7.58,32.89 8.09,32.38 13.17,32.38 14.19,31.36 34,31.36 v34.51,30.86 v79.21,30.86 79.72,31.36 111.21,31.36 v112.23,32.38 | v111.21,52.7 98.51,52.7 U$2.15
D4  (via drill 0.61)
  Top 0.254: IC2.16 95.97,72 95.97,62.35 96.99,61.34 96.99,53.72 95.97,52.7 U$2.16 95.47,50.16 94.96,49.65 94.96,45.59 94.45,45.08 94.45,42.54 91.91,40 v91.91,28.82 | v78.19,28.82 78.19,24.76 U$1.11
  Bottom 0.254: JP3.10 107.15,75.56 97.5,75.56 95.97,74.04 IC2.16 | U$1.11 77.69,24.76 77.18,25.27 47.21,25.27 46.19,24.25 18.25,24.25 17.74,24.76 15.71,24.76 13.17,27.3 8.09,27.3 7.07,28.32 7.07,48.13 8.6,48.13 JP1.9 | v78.19,28.82 v91.91,28.82
D5  (via drill 0.61)
  Top 0.254: U$2.17 92.93,52.7 91.91,53.72 91.91,65.4 92.93,66.42 92.93,72 IC2.17 | v109.69,70.48 109.69,73.02 JP3.12 | v76.67,34.41 76.16,33.9 76.16,25.27 75.65,24.76 U$1.10 | v60.92,42.54 62.45,44.06 v62.45,50.16 62.45,86.74 67.02,86.74 67.53,86.23 67.53,85.21 66.51,84.2 66.51,70.99 v67.53,70.99
  Bottom 0.254: v109.69,70.48 94.96,70.48 93.43,72 IC2.17 92.93,72 91.91,70.99 v67.53,70.99 | v76.67,34.41 76.16,33.9 62.45,33.9 61.43,34.92 58.38,34.92 57.87,35.43 57.87,36.95 58.38,36.95 58.89,37.46 58.89,42.54 v60.92,42.54 | v62.45,50.16 60.92,51.68 58.89,51.68 58.38,52.19 41.62,52.19 40.6,51.18 14.69,51.18 13.17,52.7 10.63,52.7 JP1.7
D6  (via drill 0.61)
  Top 0.254: v90.89,68.96 90.89,72 IC2.18 | v107.15,67.94 107.15,70.48 JP3.14 | v73.11,35.94 73.11,24.76 U$1.9 | v89.37,36.44 89.37,47.11 90.39,48.13 90.39,50.16 U$2.18 90.39,52.7 v90.39,54.22 | v59.4,52.7 58.89,52.19 v58.89,35.94 | v94.45,54.22 v94.45,67.94
  Bottom 0.254: v90.89,68.96 91.91,67.94 v94.45,67.94 v107.15,67.94 | v89.37,36.44 73.62,36.44 v73.11,35.94 v58.89,35.94 | v59.4,52.7 41.11,52.7 40.09,51.68 15.71,51.68 15.71,52.7 13.17,55.24 10.63,55.24 JP1.5 | v90.39,54.22 v94.45,54.22
D7  (via drill 0.61)
  Top 0.254: v72.1,34.92 72.1,26.28 70.57,24.76 U$1.8 | v96.99,35.43 96.99,47.62 v97.5,48.13 | U$2.19 88.35,50.16 88.35,49.65 v89.37,48.64 89.37,59.3 88.35,60.32 v88.35,62.86 v88.35,65.91 88.35,72 IC2.19
  Bottom 0.254: v72.1,34.92 75.65,34.92 76.67,35.94 88.35,35.94 88.86,35.43 v96.99,35.43 | v97.5,48.13 96.99,48.64 v89.37,48.64 | v88.35,62.86 87.85,63.37 80.23,63.37 79.72,62.86 60.92,62.86 58.89,64.89 41.62,64.89 39.59,62.86 8.09,62.86 8.09,57.78 JP1.3 | v88.35,65.91 88.86,65.4 98.01,65.4 98.51,65.91 100.04,65.91 100.55,65.4 109.69,65.4 109.69,67.94 JP3.16
DMA_IN  (via drill 0.61)
  Top 0.254: v113.75,55.24 114.77,54.22 114.77,34.92 114.26,34.41 114.26,30.35 v113.75,29.84 | v106.13,30.35 106.13,31.87 R12.1
  Bottom 0.254: R12.1 75.65,32.38 74.64,31.36 52.29,31.36 51.78,31.87 51.78,32.89 52.29,33.4 54.32,33.4 54.83,32.89 56.35,32.89 57.37,33.9 57.37,37.46 U$1.38 | v113.75,55.24 107.15,55.24 JP3.25 | v113.75,29.84 113.25,30.35 v106.13,30.35
DMA_OUT  (via drill 0.61)
  Top 0.254: v70.57,2.41 61.43,11.55 61.43,24.76 60.41,25.78 60.41,37.46 U$1.37 | v104.61,3.93 107.15,6.47 107.15,27.3 | 107.15,27.3 R11.1 | 107.15,27.3 107.15,52.7 JP3.27
  Bottom 0.254: v70.57,2.41 72.1,3.93 v104.61,3.93
EF1  (via drill 0.61)
  Top 0.254: U$1.24 93.43,37.46 93.43,32.89 v95.97,30.35 91.91,26.28 91.91,3.93 82.26,3.93 81.75,4.44 81.75,15.62 75.65,15.62 JP2.2 | v112.74,36.95 112.74,59.81 JP3.20
  Bottom 0.254: v95.97,30.35 99.02,30.35 R10.1 | v112.74,36.95 93.94,36.95 93.43,37.46 U$1.24
EF2  (via drill 0.61)
  Top 0.254: R9.1 105.63,6.47 105.12,5.96 96.99,5.96 96.99,33.9 95.97,34.92 95.97,37.46 U$1.23 | v110.71,11.04 110.71,36.44 110.2,36.95 110.2,59.81 JP3.22
  Bottom 0.254: JP2.4 74.13,12.06 68.54,12.06 65.49,9.01 65.49,5.96 105.12,5.96 105.63,6.47 R9.1 106.13,7.49 107.15,7.49 v110.71,11.04
EF3  (via drill 0.61)
  Top 0.254: 99.02,35.94 99.02,25.27 99.53,24.76 99.53,6.98 100.04,6.47 104.61,6.47 104.61,9.52 R8.1 | 99.02,35.94 99.02,36.95 98.51,37.46 U$1.22 | v109.69,35.94 109.69,57.78 JP3.24 | 99.02,35.94 v98.51,35.94
  Bottom 0.254: R8.1 105.12,11.55 81.75,11.55 81.24,12.06 76.67,12.06 JP2.6 | v98.51,35.94 v109.69,35.94
EF4  (via drill 0.61)
  Top 0.254: 104.1,15.62 105.63,14.09 R7.1 | 104.1,15.62 102.58,17.14 102.58,19.68 102.07,20.19 102.07,36.44 101.05,37.46 U$1.21 | v103.59,8.5 104.1,9.01 104.1,15.62 | v103.59,39.49 104.61,40.51 104.61,55.24 107.15,55.24 JP3.26
  Bottom 0.254: v103.59,8.5 101.56,6.47 77.18,6.47 JP2.8 | v103.59,39.49 101.05,39.49 U$1.21
GND  (via drill 0.61)
  Top 0.254: C18.2 15.2,74.04 15.2,71.5 12.15,68.45 C4.1 11.65,67.43 11.65,59.3 JP1.2 | IC5.7 35.01,48.64 36.03,49.65 36.03,56.76 35.01,57.78 IC10.7 | JP1.26 11.65,28.82 11.65,30.86 JP1.24 11.65,31.36 11.65,33.4 JP1.22 JP1.19 | C16.2 15.71,24.76 C15.2 | IC6.7 34.51,9.52 33.49,10.54 33.49,17.14 34.51,18.16 34.51,19.68 IC3.7 | C11.2 39.59,57.27 39.08,56.76 39.08,48.64 38.57,48.13 38.57,46.6 39.59,45.59 C10.2 | IC4.8 101.05,9.52 102.07,10.54 102.07,19.17 101.05,20.19 101.05,22.22 U$1.20 100.55,24.76 99.53,25.78 99.53,41.52 98.51,42.54 U$2.14 | IC11.7 60.41,70.48 60.41,64.89 60.92,64.38 C8.2 60.92,63.88 60.92,51.68 60.41,51.18 60.41,47.11 60.92,46.6 C7.2 60.92,46.1 v60.92,44.06 | SV1.2 47.21,88.26 46.19,89.28 43.65,89.28 43.65,75.56 C12.2
  Bottom 0.254: X1.1 10.63,84.2 13.68,81.15 21.3,81.15 21.81,80.64 IC7.15 | JP1.2 14.19,61.34 16.73,61.34 C13.2 | IC10.7 35.01,57.78 C11.2 | JP1.40 12.15,10.54 16.73,10.54 C17.2 | IC6.7 35.01,9.52 38.06,12.57 39.59,12.57 S1.2 | JP1.19 8.09,37.46 8.09,42.54 14.44,42.54 | IC8.12 29.93,42.54 30.95,43.56 38.57,43.56 39.59,44.57 C10.2 | QG1.7 67.02,8.5 68.03,9.52 79.21,9.52 C5.2 | IC4.4 90.39,9.52 90.39,10.79 | IC4.5 92.93,9.52 92.93,10.79 | IC1.1 75.15,80.64 75.15,81.91 | C9.2 71.08,82.16 69.05,84.2 44.67,84.2 43.65,85.21 43.65,89.28 46.19,89.28 47.21,88.26 SV1.2 | JP3.34 107.15,45.08 98.51,45.08 U$2.14 | v60.92,44.06 58.38,44.06 57.87,43.56 IC9.7
  Bottom 0.406: C18.2 16.98,74.29 IC7.15 | C13.2 32.22,61.59 IC10.7 | C14.2 32.22,50.16 IC5.7 | C16.2 32.22,23.49 IC3.7 | C17.2 32.22,10.79 IC6.7 | C15.2 14.44,37.46 14.44,42.54 14.44,43.81 27.14,43.81 IC8.12 | C12.2 57.62,74.29 IC11.7 | C11.2 55.08,57.78 IC12.7 | C10.2 55.08,45.08 IC9.7 | C5.2 90.39,10.79 92.93,10.79 98.26,10.79 IC4.8 | C6.2 94.45,29.84 U$1.20 | C7.2 95.72,46.35 U$2.14 | C8.2 91.91,64.13 IC2.14 | C9.2 75.15,81.91 95.72,81.91 IC1.10
INP  (via drill 0.61)
  Top 0.254: v52.29,66.42 53.81,64.89 | 53.81,64.89 53.81,52.19 54.83,51.18 IC9.9 | v58.89,95.37 53.81,90.29 53.81,64.89
  Bottom 0.254: v52.29,66.42 35.01,66.42 IC10.8 | v58.89,95.37 59.4,95.88 95.97,95.88 97.5,94.36 117.82,94.36 117.82,70.99 109.69,62.86 107.15,62.86 JP3.19
INT  (via drill 0.61)
  Top 0.254: v63.46,26.28 63.46,36.95 62.95,37.46 U$1.36
  Bottom 0.254: 107.66,21.71 108.17,22.22 114.26,22.22 117.82,25.78 117.82,54.22 108.67,54.22 JP3.28 | 107.66,21.71 106.13,20.19 R6.1 | v63.46,26.28 63.97,25.78 95.97,25.78 96.99,24.76 96.99,21.71 107.66,21.71
MRD  (via drill 0.61)
  Top 0.254: U$1.7 67.53,22.22 65.49,20.19 65.49,15.11 67.02,13.58 71.08,13.58 71.08,19.17 74.13,22.22 v74.13,32.38 74.13,33.4 77.69,36.95 79.21,36.95 79.21,47.11 79.72,47.62 79.72,49.65 80.23,50.16 U$2.22 | IC5.2 22.31,48.64 23.33,49.65 23.33,64.38 22.31,65.4 IC10.13 | IC2.22 80.73,72 v80.73,66.92 v80.73,62.35 | v103.09,51.68 102.07,52.7 v102.07,66.42 | v52.79,32.38 51.27,33.9 v51.27,58.8
  Bottom 0.254: IC10.13 22.31,65.4 23.33,64.38 35.01,64.38 36.03,65.4 61.94,65.4 62.95,66.42 80.23,66.42 v80.73,66.92 88.86,66.92 89.88,65.91 97.5,65.91 98.01,66.42 v102.07,66.42 | v103.09,51.68 105.63,51.68 JP3.29 | v52.79,32.38 v74.13,32.38 | v51.27,58.8 53.3,60.83 63.97,60.83 65.49,62.35 v80.73,62.35
MWR
  Top 0.254: U$1.35 65.49,40 66.51,41.02 66.51,46.6 67.02,47.11 67.02,49.65 67.53,50.16 U$2.27
  Bottom 0.254: JP3.30 107.15,50.16 99.53,50.16 99.02,49.65 68.54,49.65 68.03,50.16 U$2.27
N$1  (via drill 0.61)
  Top 0.254: v30.95,74.54 30.95,32.38 28.41,29.84 28.41,27.3 27.9,26.79 27.9,22.73 27.39,22.22 IC3.4 | v85.31,67.94 85.31,72 IC2.20
  Bottom 0.254: v30.95,74.54 31.97,75.56 65.49,75.56 66.51,74.54 66.51,67.94 v85.31,67.94
N$2  (via drill 0.61)
  Top 0.254: v41.11,70.48 41.11,57.27 42.13,56.26 IC12.1
  Bottom 0.254: v41.11,70.48 44.16,73.53 56.86,73.53 57.37,73.02 IC11.6
N$3  (via drill 0.61)
  Top 0.254: v84.29,19.68 84.29,14.6 83.78,14.09 83.78,10.03 83.27,9.52 IC4.1 | v98.01,20.7 98.01,22.22 U$1.19
  Bottom 0.254: v84.29,19.68 87.85,19.68 88.86,20.7 v98.01,20.7
N$4  (via drill 0.61)
  Top 0.254: v86.83,20.7 86.83,10.54 85.81,9.52 IC4.2
  Bottom 0.254: v86.83,20.7 87.34,21.2 94.45,21.2 95.47,22.22 U$1.18
N$5  (via drill 0.61)
  Top 0.254: v89.37,19.68 89.37,10.54 88.35,9.52 IC4.3 | v92.93,19.68 92.93,22.22 U$1.17
  Bottom 0.254: v89.37,19.68 v92.93,19.68
N$6  (via drill 0.61)
  Top 0.254: v20.79,3.42 20.79,17.14 19.77,18.16 19.77,19.68 IC3.1 | v82.77,4.95 84.29,6.47 84.29,13.58 85.31,14.6 IC4.15 | v17.74,66.42 17.74,68.45 22.82,68.45 23.33,67.94 24.35,67.94 IC10.12
  Bottom 0.254: v82.77,4.95 71.59,4.95 69.05,2.41 24.85,2.41 23.84,3.42 v20.79,3.42 4.53,3.42 4.53,60.32 9.61,65.4 16.73,65.4 v17.74,66.42
N$7  (via drill 0.61)
  Top 0.254: v21.81,25.27 21.81,22.22 IC3.2 | v19.27,26.28 18.25,27.3 18.25,46.1 19.27,47.11 IC5.1
  Bottom 0.254: v21.81,25.27 20.79,26.28 v19.27,26.28
N$8
  Top 0.254: IC6.10 29.93,14.6 29.93,10.54 30.95,9.52 30.95,6.98 29.43,5.46 27.39,5.46 27.39,6.98 IC6.4
  Bottom 0.254: IC6.3 24.85,6.98 26.89,6.98 IC6.4
N$9
  Bottom 0.254: IC5.3 24.85,46.6 25.87,45.59 28.41,45.59 29.43,46.6 IC5.5
N$10  (via drill 0.61)
  Top 0.254: IC6.5 29.43,9.52 28.41,10.54 28.41,17.14 IC3.6 | IC6.13 22.31,17.14 23.33,18.16 v23.33,19.17 23.33,43.05 26.89,46.6 IC5.4
  Bottom 0.254: v23.33,19.17 31.46,19.17 31.97,19.68 IC3.6
N$11
  Bottom 0.254: IC6.2 22.31,9.52 22.82,10.03 31.46,10.03 31.97,9.52 IC6.6
N$12  (via drill 0.61)
  Top 0.254: v19.77,12.06 19.77,9.52 IC6.1 | v30.95,12.06 31.97,13.08 31.97,14.6 IC6.9 32.47,17.14 33.49,18.16 33.49,22.22 34,22.73 34,26.79 34.51,27.3 IC3.8
  Bottom 0.254: v19.77,12.06 v30.95,12.06
N$13  (via drill 0.61)
  Top 0.254: v21.81,2.41 25.87,6.47 25.87,17.14 28.41,19.68 28.41,26.28 29.43,27.3 IC3.10
  Bottom 0.254: v21.81,2.41 3.52,2.41 3.01,2.92 3.01,66.92 16.73,66.92 18.25,68.45 27.9,68.45 28.41,67.94 28.41,64.89 31.46,64.89 31.97,65.4 IC10.9
N$14
  Bottom 0.254: IC6.12 24.85,14.6 25.36,14.09 34,14.09 34.51,14.6 IC6.8
N$15  (via drill 0.61)
  Top 0.254: v46.19,25.78 46.7,26.28 46.7,41.02 47.21,41.52 IC9.3
  Bottom 0.254: v46.19,25.78 45.68,26.28 23.33,26.28 22.31,27.3 IC3.13
N$16  (via drill 0.61)
  Top 0.254: v28.41,6.47 28.41,9.52 27.9,10.03 27.9,14.09 27.39,14.6 IC6.11 | v47.21,6.47 47.71,6.98 v47.71,33.4 | v44.16,34.92 43.65,35.43 43.65,51.68 45.17,53.21 46.19,53.21 v46.19,67.43
  Bottom 0.254: v28.41,6.47 v47.21,6.47 | v47.71,33.4 46.19,34.92 v44.16,34.92 | v46.19,67.43 45.17,68.45 30.44,68.45 29.93,67.94 IC10.10
N$17
  Top 0.254: IC3.11 27.39,29.84 28.41,30.86 28.41,64.38 27.39,65.4 IC10.11
N$19  (via drill 0.61)
  Top 0.254: v62.45,12.06 62.45,22.22 U$1.5 | v6.57,5.46 7.07,5.96 7.07,86.23 v11.65,90.8 | v105.63,91.82 109.69,95.88 115.79,95.88 v115.79,53.21
  Bottom 0.254: v62.45,12.06 53.81,3.42 25.87,3.42 23.84,5.46 v6.57,5.46 | v11.65,90.8 12.66,91.82 73.11,91.82 75.15,93.85 93.94,93.85 95.97,91.82 v105.63,91.82 | v115.79,53.21 111.72,49.14 108.67,49.14 JP3.32
N$20  (via drill 0.61)
  Top 0.254: v26.89,25.27 26.89,24.25 24.85,22.22 IC3.3 | v29.43,25.27 30.44,24.25 33.49,24.25 v33.49,35.43 | v47.71,35.94 48.73,36.95 48.73,53.21 | 48.73,53.21 47.71,54.22 IC12.3 | v96.99,66.92 v96.99,62.86 | v91.91,66.92 91.91,90.29 85.81,96.39 48.73,96.39 48.73,53.21
  Bottom 0.254: v26.89,25.27 v29.43,25.27 | v33.49,35.43 34,35.94 v47.71,35.94 | v96.99,62.86 101.05,58.8 104.1,58.8 104.1,57.27 100.04,53.21 86.32,53.21 85.81,52.7 U$2.20 | v91.91,66.92 v96.99,66.92
N$21  (via drill 0.61)
  Top 0.254: v17.23,78.61 22.31,73.53 26.89,73.53 26.89,73.02 IC7.4
  Bottom 0.254: v17.23,78.61 14.69,78.61 12.15,76.07 C2.1
N$22
  Top 0.254: C2.2 9.61,76.07 10.63,77.08 10.63,80.13 11.65,81.15 28.41,81.15 28.41,74.04 29.43,73.02 IC7.5
N$23
  Top 0.254: IC3.12 24.85,29.84 26.89,31.87 26.89,32.38 IC8.4 27.39,34.92 27.39,40 IC8.13
N$24  (via drill 0.61)
  Top 0.254: v19.27,45.59 19.27,42.54 IC8.16 | v14.69,45.59 14.69,19.17 14.19,18.66 v14.19,17.14
  Bottom 0.254: v14.69,45.59 v19.27,45.59 | v14.19,17.14 10.63,17.14 JP1.35
N$25  (via drill 0.61)
  Top 0.254: v20.79,19.17 20.79,38.98 21.81,40 IC8.15
  Bottom 0.254: v20.79,19.17 13.68,19.17 13.17,19.68 10.63,19.68 JP1.33
N$26  (via drill 0.61)
  Top 0.254: v36.03,18.16 36.03,38.98 35.01,40 IC8.10
  Bottom 0.254: v36.03,18.16 35.52,17.65 16.22,17.65 14.69,16.12 12.15,16.12 JP1.36
N$27  (via drill 0.61)
  Top 0.254: v38.06,16.63 38.06,27.81 38.57,28.32 38.57,38.98 37.55,40 IC8.9
  Bottom 0.254: v38.06,16.63 34.51,13.08 18.76,13.08 17.74,12.06 10.63,12.06 JP1.37
N$28  (via drill 0.61)
  Top 0.254: v37.05,20.7 37.05,32.38 IC8.8 | v15.2,15.11 v15.2,18.16
  Bottom 0.254: v37.05,20.7 34.51,18.16 v15.2,18.16 | v15.2,15.11 13.68,13.58 12.15,13.58 JP1.38
N$29  (via drill 0.61)
  Top 0.254: v30.95,30.35 v30.95,25.27 | v44.67,25.27 44.67,31.87 R14.2
  Bottom 0.254: R14.2 45.17,31.87 45.68,31.36 49.24,31.36 53.81,35.94 53.81,41.52 54.83,41.52 IC9.6 | v30.95,30.35 18.76,30.35 18.25,29.84 10.63,29.84 JP1.23 | v30.95,25.27 v44.67,25.27
N$30  (via drill 0.61)
  Top 0.254: v46.19,47.11 46.19,38.98 45.17,37.97 R13.2 45.17,36.95 45.17,34.41 43.65,32.89 43.65,24.76 46.19,22.22 46.19,1.39 21.3,1.39 13.17,9.52 13.17,27.3 10.63,27.3 JP1.25
  Bottom 0.254: v46.19,47.11 47.21,48.13 56.35,48.13 57.37,49.14 IC9.8
N$31
  Bottom 0.254: C1.2 9.11,79.62 9.11,88.26 20.79,88.26 28.41,80.64 28.41,74.04 25.87,74.04 24.85,73.02 IC7.3
N$32
  Bottom 0.254: IC7.13 26.89,80.64 24.35,83.18 17.23,83.18 16.22,84.2 X1.3
N$33  (via drill 0.61)
  Top 0.254: v18.25,49.14 20.79,51.68 20.79,56.76 19.77,57.78 IC10.1 | v33.49,4.44 38.57,9.52 38.57,14.6 40.09,16.12 S1.1
  Bottom 0.254: v18.25,49.14 14.19,49.14 13.17,50.16 8.09,50.16 5.04,47.11 5.04,6.47 7.07,6.47 7.58,5.96 26.38,5.96 27.9,4.44 v33.49,4.44
N$34
  Top 0.254: IC7.1 19.27,73.02 17.23,75.05 17.23,77.08 15.2,79.12 12.15,79.12 C1.1
N$35
  Top 0.254: X1.7 14.69,86.74 16.73,86.74 X1.8
N$36
  Bottom 0.254: X1.2 13.68,84.7 14.69,85.72 18.25,85.72 19.27,86.74 X1.9
N$37  (via drill 0.61)
  Top 0.254: v72.61,2.92 72.61,8 JP2.7 72.61,8.5 72.61,10.54 JP2.5 72.61,11.04 72.61,13.08 JP2.3 72.61,13.58 72.61,15.62 JP2.1
  Bottom 0.254: v72.61,2.92 71.08,1.39 2.5,1.39 2.5,67.43 4.03,68.96 33.49,68.96 33.49,73.02 32.98,73.53 29.93,73.53 29.93,78.1 IC7.12
N$38
  Bottom 0.254: C3.1 13.17,73.02 18.25,73.02 18.76,73.53 21.3,73.53 21.81,73.02 IC7.2
N$39  (via drill 0.61)
  Top 0.254: v11.14,69.97 9.61,68.45 C4.2
  Bottom 0.254: v11.14,69.97 31.46,69.97 31.97,70.48 IC7.6
N$40
  Top 0.254: IC7.7 34.51,73.02 30.95,76.58 30.95,80.64 29.43,82.16 18.76,82.16 18.76,84.2 X1.4
N$43  (via drill 0.61)
  Top 0.254: v25.87,53.72 25.87,68.45 27.9,68.45 28.41,67.94 28.41,65.4 28.92,64.89 28.92,60.83 29.43,60.32 IC10.5 | v38.06,52.7 38.06,44.06 39.59,42.54 39.59,28.32 43.14,24.76 v43.14,21.2
  Bottom 0.254: v25.87,53.72 26.89,52.7 v38.06,52.7 | v43.14,21.2 46.19,18.16 46.19,10.54 44.67,10.54 S1.3
N$46
  Bottom 0.254: IC10.2 22.31,60.32 22.82,60.83 31.46,60.83 31.97,60.32 IC10.6
OUT  (via drill 0.61)
  Top 0.254: v44.67,47.11 44.67,43.56 IC9.2 | v113.75,60.32 112.74,61.34 v112.74,86.74 | v43.65,92.83 36.03,85.21 36.03,62.86 33.49,60.32 33.49,49.65 32.47,48.64 IC5.6
  Bottom 0.254: IC9.2 45.17,41.52 46.19,40.51 48.73,40.51 49.75,41.52 IC9.4 | v44.67,47.11 44.16,46.6 38.06,46.6 37.05,45.59 33.49,45.59 32.47,46.6 IC5.6 | v113.75,60.32 107.15,60.32 JP3.21 | v112.74,86.74 106.64,92.83 95.97,92.83 94.45,94.36 61.43,94.36 59.91,92.83 v43.65,92.83
PORT1  (via drill 0.61)
  Top 0.254: v86.83,26.79 86.83,22.22 87.85,21.2 87.85,17.14 IC4.14 | v66,26.79 66,36.95 66.51,37.46 66.51,40 69.05,42.54 v69.05,53.21 | v87.34,54.73 86.83,55.24 86.83,75.05 89.37,77.59 v89.37,91.31 | v92.42,91.31 94.45,89.28 94.45,85.72 98.51,81.66 100.55,81.66 v100.55,60.83
  Bottom 0.254: v66,26.79 v86.83,26.79 | v69.05,53.21 71.08,55.24 74.64,55.24 75.15,54.73 80.23,54.73 80.73,55.24 82.26,55.24 82.77,54.73 v87.34,54.73 | v89.37,91.31 v92.42,91.31 | v100.55,60.83 102.07,59.3 105.63,59.3 JP3.23
PORT2  (via drill 0.61)
  Top 0.254: v49.75,37.46 50.76,36.44 v50.76,20.19 | v103.09,47.11 v103.09,44.06 | v115.79,47.62 115.28,47.11 115.28,34.41 114.77,33.9 v114.77,21.2
  Bottom 0.254: v49.75,37.46 46.7,37.46 42.63,41.52 IC9.1 | v50.76,20.19 52.29,18.66 92.93,18.66 | 92.93,18.66 94.45,17.14 94.45,14.09 91.4,14.09 90.89,14.6 IC4.13 | v103.09,44.06 105.63,44.06 JP3.35 | v103.09,47.11 103.59,47.62 v115.79,47.62 | v114.77,21.2 112.23,18.66 92.93,18.66
PORT3  (via drill 0.61)
  Top 0.254: IC9.10 52.29,49.14 52.29,43.56 IC9.5 52.79,41.52 53.81,40.51 53.81,18.16 v54.32,17.65 | v113.75,42.54 113.75,31.36 112.74,30.35 112.74,9.52 106.13,2.92 94.45,2.92 94.45,13.58 93.43,14.6 IC4.12
  Bottom 0.254: v54.32,17.65 92.42,17.65 92.93,17.14 IC4.12 | v113.75,42.54 107.15,42.54 JP3.37
PORT4  (via drill 0.61)
  Top 0.254: v103.59,17.65 104.61,18.66 104.61,37.46 JP3.39
  Bottom 0.254: v103.59,17.65 96.48,17.65 95.97,17.14 IC4.11
PORT5  (via drill 0.61)
  Top 0.254: v116.8,13.58 117.31,14.09 117.31,40 v116.8,40.51
  Bottom 0.254: v116.8,13.58 99.53,13.58 98.51,14.6 IC4.10 | v116.8,40.51 116.8,43.56 108.67,43.56 JP3.36
PORT6  (via drill 0.61)
  Top 0.254: v111.72,16.63 111.21,17.14 v111.21,41.02
  Bottom 0.254: v111.72,16.63 101.05,16.63 IC4.9 | v111.21,41.02 108.67,41.02 JP3.38
PORT7  (via drill 0.61)
  Top 0.254: v98.51,13.08 98.51,9.52 IC4.7 | v109.18,12.06 109.69,12.57 109.69,34.41 108.67,35.43 108.67,38.48 JP3.40
  Bottom 0.254: v98.51,13.08 99.02,12.57 108.67,12.57 v109.18,12.06
Q  (via drill 0.61)
  Top 0.254: v57.37,5.46 57.37,19.68 59.91,22.22 U$1.4 | v13.17,4.44 8.09,9.52 8.09,37.46 10.63,37.46 10.63,64.89 8.09,67.43 8.09,80.13 11.14,83.18 17.23,83.18 17.23,85.72 24.85,85.72 24.85,87.24 26.89,89.28 34.51,89.28 | 34.51,89.28 34.51,80.64 IC7.10 | v99.02,46.1 100.04,45.08 v100.04,44.06 | v103.09,42.54 104.1,43.56 104.1,64.89 104.61,65.4 111.72,65.4 v111.72,89.28 | 34.51,89.28 v34.51,93.85
  Bottom 0.254: v57.37,5.46 54.83,2.92 25.36,2.92 23.84,4.44 v13.17,4.44 | v99.02,46.1 105.63,46.1 JP3.33 | v100.04,44.06 101.56,42.54 v103.09,42.54 | v111.72,89.28 107.66,93.34 96.48,93.34 94.96,94.86 60.92,94.86 59.91,93.85 v34.51,93.85
RESET  (via drill 0.61)
  Top 0.254: v56.35,66.42 v56.35,53.72 56.35,25.78 57.37,24.76 U$1.3
  Bottom 0.254: JP1.1 10.63,57.78 18.25,57.78 18.76,57.27 23.84,57.27 24.35,57.78 IC10.3 24.85,57.78 26.89,57.78 IC10.4 27.39,57.78 27.9,57.27 37.55,57.27 41.62,53.21 55.84,53.21 v56.35,53.72 | v56.35,66.42 53.3,69.46 46.19,69.46 45.17,70.48 IC11.1
SC0  (via drill 0.61)
  Top 0.254: v80.23,34.92 76.67,31.36 76.67,22.22 71.59,17.14 71.59,13.08 66.51,13.08 64.99,14.6 64.99,22.22 U$1.6 | v103.09,34.41 102.58,34.92 102.58,40 101.56,41.02 v101.56,49.14
  Bottom 0.254: v80.23,34.92 95.97,34.92 96.48,34.41 v103.09,34.41 | v101.56,49.14 105.63,49.14 JP3.31
TPA  (via drill 0.61)
  Top 0.254: JP3.17 104.61,67.94 104.61,86.74 98.51,86.74 IC1.11 98.01,88.26 v98.01,95.37 | v67.02,27.81 67.53,28.32 67.53,37.46 U$1.34 | v47.71,95.37 38.57,86.23 38.57,54.73 37.05,53.21 37.05,44.06 39.08,42.03 v39.08,27.3
  Bottom 0.254: 39.08,26.79 62.45,26.79 63.46,27.81 v67.02,27.81 | 39.08,26.79 32.98,26.79 32.47,27.3 IC3.9 | v98.01,95.37 96.99,96.39 48.73,96.39 v47.71,95.37 | 39.08,26.79 v39.08,27.3
TPB  (via drill 0.61)
  Top 0.254: v67.53,14.6 69.05,16.12 69.05,36.44 70.07,37.46 U$1.33 | v110.71,91.82 110.71,68.96 JP3.18 | v14.19,94.86 6.57,87.24 6.57,24.76 v6.06,24.25
  Bottom 0.254: 8.09,22.22 17.74,22.22 18.25,22.73 28.92,22.73 29.43,22.22 IC3.5 | 8.09,22.22 8.09,6.47 27.39,6.47 27.39,5.96 27.9,5.46 54.32,5.46 63.46,14.6 v67.53,14.6 | v110.71,91.82 108.67,93.85 96.99,93.85 95.47,95.37 60.41,95.37 59.4,94.36 35.52,94.36 35.01,94.86 v14.19,94.86 | 8.09,22.22 v6.06,24.25
VCC  (via drill 0.61)
  Top 0.254: U$2.28 64.99,52.7 63.97,53.72 63.97,70.99 64.99,72 IC2.28 | SV1.1 44.67,85.72 44.67,80.64 IC11.14 45.17,78.1 45.17,75.05 47.21,73.02 IC11.2 47.21,70.48 45.17,68.45 45.17,66.42 42.63,63.88 IC12.14 42.63,61.84 43.65,60.83 43.65,52.7 42.63,51.68 42.63,51.18 IC9.14 | v95.47,12.57 95.47,9.52 IC4.6 | R12.2 108.17,31.87 108.17,28.82 R11.2 108.17,28.32 108.17,23.74 R10.2 108.17,23.24 108.17,20.19 R6.2 108.17,19.17 108.17,15.11 R7.2 108.17,14.09 108.17,11.04 R8.2 108.17,10.54 108.17,7.49 R9.2 | U$1.2 55.33,22.22 55.33,16.12 51.78,16.12 QG1.14 50.76,16.12 49.75,17.14 49.75,30.86 48.73,31.87 C6.1 | R14.1 42.13,32.89 42.13,36.95 R13.1 42.13,37.97 41.11,38.98 41.11,46.1 40.09,47.11 C10.1 | IC6.14 19.27,17.14 18.25,18.16 18.25,24.76 C16.1 16.73,26.28 16.73,37.97 16.22,38.48 C15.1 15.71,51.18 | 15.71,51.18 16.73,52.19 C14.1 | 15.71,51.18 15.71,62.86 C13.1 16.73,64.38 16.73,76.07 16.22,76.58 C18.1 | v82.77,21.2 82.77,17.14 IC4.16
  Bottom 0.254: 62.06,69.84 61.94,69.97 53.3,69.97 52.79,70.48 IC11.4 52.29,70.48 51.78,69.97 48.22,69.97 47.71,70.48 IC11.2 | C9.1 71.08,84.7 46.19,84.7 45.17,85.72 SV1.1 | C5.1 80.73,13.08 94.96,13.08 v95.47,12.57 95.97,12.06 107.15,12.06 R8.2 | 82.77,21.71 55.84,21.71 55.33,22.22 U$1.2 | 82.77,21.71 89.88,21.71 90.39,22.22 U$1.16 | C6.1 47.21,32.38 46.19,33.4 43.14,33.4 42.63,32.89 R14.1 42.13,31.87 30.44,31.87 29.93,32.38 IC8.5 | C3.2 12.15,74.54 13.17,74.54 15.2,76.58 C18.1 | 82.77,21.71 v82.77,21.2
  Bottom 0.406: C18.1 16.98,76.83 IC7.16 | C13.1 IC10.14 | C14.1 IC5.14 | C16.1 IC3.14 | C17.1 IC6.14 | C15.1 24.6,38.73 IC8.5 | IC11.14 C12.1 | IC12.14 C11.1 | C10.1 IC9.14 | IC4.16 C5.1 | C6.1 48.73,34.92 U$1.40 | C7.1 62.7,48.89 U$2.28 | C8.1 61.43,69.21 62.06,69.84 IC2.28 | C9.1 72.86,84.45 IC1.20